# Altium project DAAD_DIMER.PrjPcb
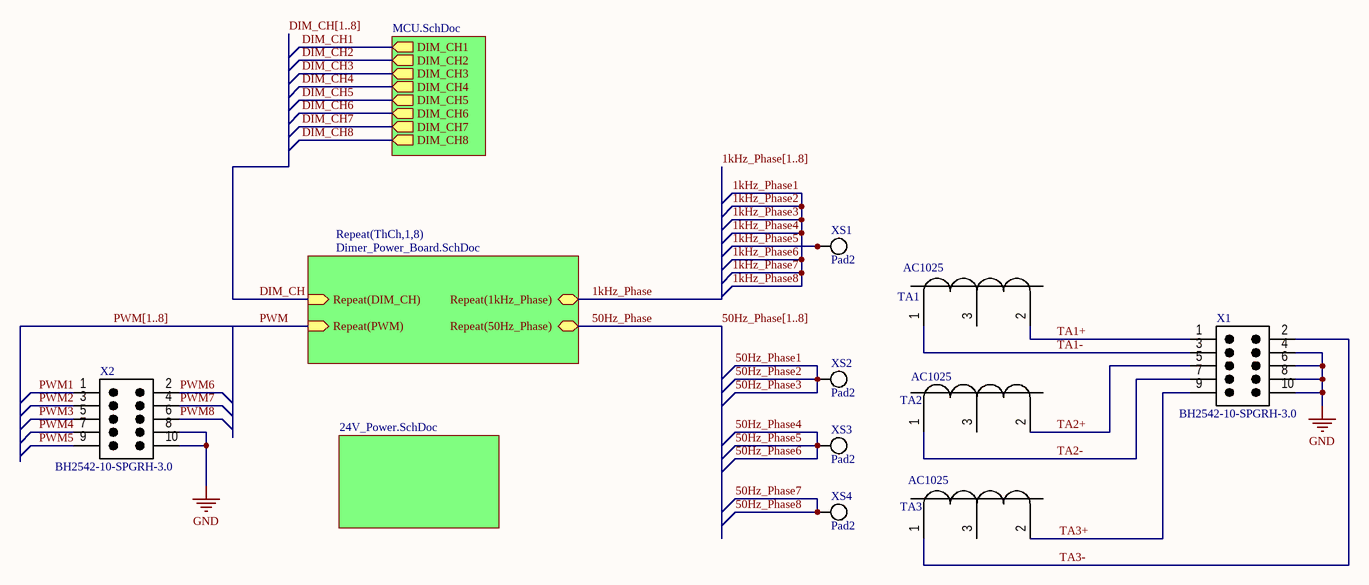
[diagram p0: DAAD_DIMER_Sheet.SchDoc]
4 sheets, 203 parts. Net scope: hierarchical (ports join the sheet entries above them; power ports are global).
Board file: DIMER_PCB.PcbDoc
Sheets:
  DAAD_DIMER_Sheet.SchDoc
    ThCh1 = Dimer_Power_Board.SchDoc
    ThCh2 = Dimer_Power_Board.SchDoc
    ThCh3 = Dimer_Power_Board.SchDoc
    ThCh4 = Dimer_Power_Board.SchDoc
    ThCh5 = Dimer_Power_Board.SchDoc
    ThCh6 = Dimer_Power_Board.SchDoc
    ThCh7 = Dimer_Power_Board.SchDoc
    ThCh8 = Dimer_Power_Board.SchDoc
    24V_Power = 24V_Power.SchDoc
    Designator = MCU.SchDoc

## Sheet DAAD_DIMER_Sheet.SchDoc: Багатоканальний пристрій регулювання потужності
size 420 x 297 mm; ApprovedBy: Хоменко М.А.; CheckedBy: Хоменко М.А.; Author: Шокодько Д.А.; CompanyName: НУЧП; DocumentNumber: МРА.EH 14194617; Revision: Хоменко М.А.; SheetNumber: 1; SheetTotal: 4; Scale: 1:1; Title2str: електричних нагрівальних елементів; DocumentType: Схема електрична принципова; FirstReferrence: АБВГ.123456.001; T_Contr: Хоменко М.А.; N_Contr: Хоменко М.А.

### Parts
TA1  AC1025  [10K_TRIM]
TA2  AC1025  [10K_TRIM]
TA3  AC1025  [10K_TRIM]
X1  BH2542-10-SPGRH-3.0  [PCE-BH2542-10-SPGRH-3.0]
X2  BH2542-10-SPGRH-3.0  [PCE-BH2542-10-SPGRH-3.0]
XS1  Pad2  [LOTPAD_2]
XS2  Pad2  [LOTPAD_2]
XS3  Pad2  [LOTPAD_2]
XS4  Pad2  [LOTPAD_2]

### Sub-sheets
24V_Power = 24V_Power.SchDoc: no entries
Designator = MCU.SchDoc: DIM_CH2 (out), DIM_CH5 (out), DIM_CH8 (out), DIM_CH6 (out), DIM_CH4 (out), DIM_CH3 (out), DIM_CH7 (out), DIM_CH1 (out)
Repeat(ThCh,1,8) = Dimer_Power_Board.SchDoc: Repeat(PWM) (in), Repeat(50Hz_Phase) (bidir), Repeat(DIM_CH) (in), Repeat(1kHz_Phase) (bidir)

### Nets
GND: X1.4 X1.6 X1.8 X1.10 X2.8 X2.10
1kHz_Phase: sheet Repeat(ThCh,1,8)/Repeat(1kHz_Phase)
1kHz_Phase5: XS1.1 XS1.2
50Hz_Phase: sheet Repeat(ThCh,1,8)/Repeat(50Hz_Phase)
50Hz_Phase1: XS2.1 XS2.2  [also labelled 50Hz_Phase2, 50Hz_Phase3]
50Hz_Phase4: XS3.1 XS3.2  [also labelled 50Hz_Phase5, 50Hz_Phase6]
50Hz_Phase7: XS4.1 XS4.2  [also labelled 50Hz_Phase8]
DIM_CH: sheet Repeat(ThCh,1,8)/Repeat(DIM_CH)
PWM: sheet Repeat(ThCh,1,8)/Repeat(PWM)
PWM1: X2.1
PWM2: X2.3
PWM3: X2.5
PWM4: X2.7
PWM5: X2.9
PWM6: X2.2
PWM7: X2.4
PWM8: X2.6
TA1+: TA1.2 X1.1
TA1-: TA1.1 X1.3
TA2+: TA2.2 X1.5
TA2-: TA2.1 X1.7
TA3+: TA3.2 X1.9
TA3-: TA3.1 X1.2

Not connected (* = marked no-connect by the designer): TA1 3; TA2 3; TA3 3

### Buses and harness runs
bus 1kHz_Phase[1..8]
bus 50Hz_Phase[1..8]
bus DIM_CH[1..8]
bus PWM[1..8]

### Notes on the sheet
- Перше використання
- Довідн. №
- Підп. і дата
- Інв. № дубл.
- Взамін інв. №
- Розроб.
- Зм.
- Лист
- № докум.
- Підп.
- Дата
- Літ.
- Маса
- Масштаб
- Перевір.
- Т.контр.
- Листів
- Інв. № оригін.
- Затв.
- Н.контр.
- 2.106-A3
- Формат А3

### Library data of the parts
TA1-TA3 = Talema 45/15 AC1025: Talema India Current Trancducer 45/15 AC1025
X1 X2 = PCE-HDR-2P-M-R10: Box Header, Pitch 2.54 mm, 2x5 Position, Height 9 mm, Tail Length 3 mm; Manufacturer: Pinchao Electronic; Insulator Material: NY-6T; Insulator resistance (Min.): 1000 Megohms; Plating: Gold Flash; No. of positions: 10; No. of Rows: 2; Dielectric Withstaanding: AC 500 V; Current Rating: 3 Amps; Pitch: 2.54 mm; ComponentLink1Description: Manufacturer URL; PartNumber: BH2542-10-SPGRH-3.0; PackageReference: BH2542-10-SPGRH-3.0; ComponentLink1URL: http://www.suzhoupinchao.com/; PackageDescription: Box Header, Pitch 2.54 mm, 2x5 Position, Height 9 mm, Tail Length 3 mm; Connector Type: Box Header; Mounting Technology: Through Hole; Operating Temperature: -40 to 105 degC
XS1-XS4 = Pad2: PCB TH Pad

## Sheet Dimer_Power_Board.SchDoc: Багатоканальний пристрій регулювавання потужності
size 420 x 297 mm; CheckedBy: Хоменко М.А.; Author: Шокодько Д.А.; CompanyName: НУЧП; DocumentNumber: МРА.ЕН 14194617; Revision: Хоменко М.А.; SheetNumber: 2; SheetTotal: 4; Scale: 1:1; Title2str: електричних нагрівальних елементів; DocumentType: Схема електрична принципова; FirstReferrence: АБВГ.123456.001; T_Contr: Хоменко М.А.; N_Contr: Хоменко М.А.
Used 8 times, as channels ThCh1, ThCh2, ThCh3, ThCh4, ThCh5, ThCh6, ThCh7, ThCh8. Parts and nets are listed once, with the designators drawn on the sheet.
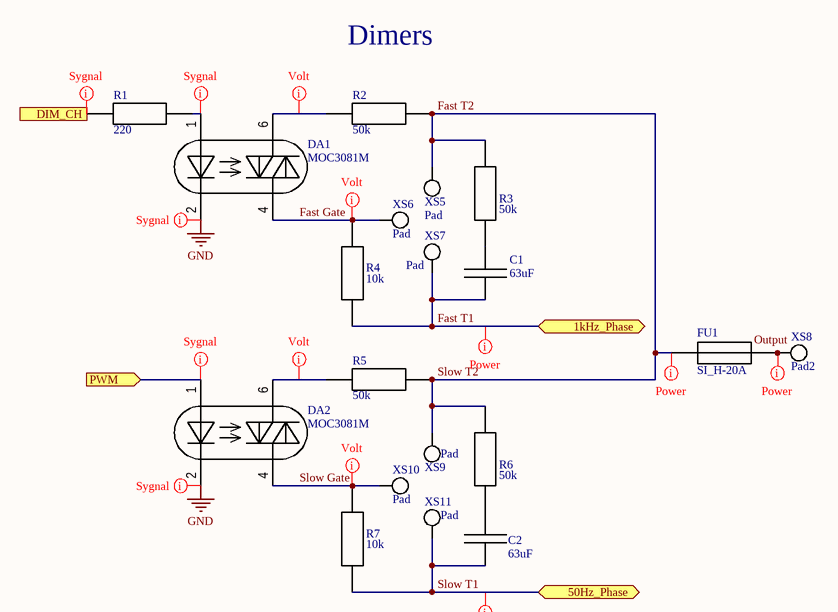
[diagram p1: Dimer_Power_Board.SchDoc]

### Parts
C1  63uF  [C-15]
C2  63uF  [C-15]
DA1  MOC3081M  [DIL-06]
DA2  MOC3081M  [DIL-06]
FU1  SI_H-20A  [SI_H-20A_]
R1  220  [RESC2012X06N]
R2  50k  [R-15]
R3  50k  [R-15]
R4  10k  [R-10]
R5  50k  [R-15]
R6  50k  [R-15]
R7  10k  [R-10]
XS5  Pad  [LOTPAD]
XS6  Pad  [LOTPAD]
XS7  Pad  [LOTPAD]
XS8  Pad2  [LOTPAD_2]
XS9  Pad  [LOTPAD]
XS10  Pad  [LOTPAD]
XS11  Pad  [LOTPAD]

### Ports
1kHz_Phase (bidir), 50Hz_Phase (bidir), DIM_CH (in), PWM (in)

### Nets
GND: DA1.2(Cathode) DA2.2(Cathode)
DIM_CH: R1.1 ; port DIM_CH
Fast Gate: DA1.4(Main_terminal) R4.2 XS6.1
Fast T1: C1.1 R4.1 XS7.1 ; port 1kHz_Phase
Fast T2: FU1.3 R2.2 R3.2 R5.2 R6.2 XS5.1 XS9.1  [also labelled Slow T2]
PWM: DA2.1(Anode) ; port PWM
Slow Gate: DA2.4(Main_terminal) R7.2 XS10.1
Slow T1: C2.1 R7.1 XS11.1 ; port 50Hz_Phase
NetC1_2: C1.2 R3.1
NetC2_2: C2.2 R6.1
NetDA1_1: DA1.1(Anode) R1.2
NetDA1_6: DA1.6(Main_terminal) R2.1
NetDA2_6: DA2.6(Main_terminal) R5.1
NetFU1_2: FU1.2 XS8.1 XS8.2

### Channels
ThCh1: designators end in _ThCh1; ports 1kHz_Phase=1kHz_Phase1 50Hz_Phase=50Hz_Phase1 DIM_CH=DIM_CH1 PWM=PWM1
ThCh2: designators end in _ThCh2; ports 1kHz_Phase=1kHz_Phase1 50Hz_Phase=50Hz_Phase1 DIM_CH=DIM_CH2 PWM=PWM2
ThCh3: designators end in _ThCh3; ports 1kHz_Phase=1kHz_Phase1 50Hz_Phase=50Hz_Phase1 DIM_CH=DIM_CH3 PWM=PWM3
ThCh4: designators end in _ThCh4; ports 1kHz_Phase=1kHz_Phase1 50Hz_Phase=50Hz_Phase4 DIM_CH=DIM_CH4 PWM=PWM4
ThCh5: designators end in _ThCh5; ports 1kHz_Phase=1kHz_Phase5 50Hz_Phase=50Hz_Phase4 DIM_CH=DIM_CH5 PWM=PWM5
ThCh6: designators end in _ThCh6; ports 1kHz_Phase=1kHz_Phase1 50Hz_Phase=50Hz_Phase4 DIM_CH=DIM_CH6 PWM=PWM6
ThCh7: designators end in _ThCh7; ports 1kHz_Phase=1kHz_Phase1 50Hz_Phase=50Hz_Phase7 DIM_CH=DIM_CH7 PWM=PWM7
ThCh8: designators end in _ThCh8; ports 1kHz_Phase=1kHz_Phase1 50Hz_Phase=50Hz_Phase7 DIM_CH=DIM_CH8 PWM=PWM8

### Layout directives
net class Sygnal; rule Width Constraint [Pref Width = 0.45mm    Min Width = 0.25mm    Max Width = 0.6mm]; rule Clearance Constraint [Clearance = 0.4mm]: DIM_CH1, GND, NetDA1_ThCh1_1, PWM1
net class Volt; rule Width Constraint [Pref Width = 0.7mm    Min Width = 0.4mm    Max Width = 1mm]; rule Clearance Constraint [Clearance = 3mm]: Fast Gate_ThCh1, NetDA1_ThCh1_6, NetDA2_ThCh1_6, Slow Gate_ThCh1
net class High Cur Volt; rule Width Constraint [Pref Width = 3.5mm    Min Width = 1.5mm    Max Width = 12mm]; rule Clearance Constraint [Clearance = 3mm]: 1kHz_Phase1, 50Hz_Phase1, Fast T2_ThCh1, NetFU1_ThCh1_2

### Notes on the sheet
- Dimers
- Labels drawn without touching a wire or pin: Output
- Перше використання
- Довідн. №
- Підп. і дата
- Інв. № дубл.
- Взамін інв. №
- Розроб.
- Зм.
- Лист
- № докум.
- Підп.
- Дата
- Літ.
- Маса
- Масштаб
- Перевір.
- Т.контр.
- Листів
- Інв. № оригін.
- Затв.
- Н.контр.
- 2.106-A3
- Формат А3

### Library data of the parts
C1 C2 = C_15: Value: *
DA1 DA2 = MOC3081M: MOC3081M Optosimistor Driver; ClassName: VS
FU1 = Fuse SI_H-20A: ClassName: FU
R1 = 220: Resistor
R2 R3 R5 R6 = Res_15: Value: *
R4 R7 = Res_10: Value: *
XS5-XS7 XS9-XS11 = Pad: PCB TH Pad
XS8 = Pad2: PCB TH Pad

## Sheet 24V_Power.SchDoc: Багатоканальний пристрій регулювання потужності
size 420 x 297 mm; CheckedBy: Хоменко М.А.; Author: Шокодько Д.А.; CompanyName: НУЧП; DocumentNumber: МРА.ЕН 14194617; Revision: Хоменко М.А.; SheetNumber: 3; SheetTotal: 4; Scale: 1:1; Title2str: електричних нагрівальних елементів; DocumentType: Схема електрична принципова; FirstReferrence: АБВГ.123456.001; T_Contr: Хоменко М.А.; N_Contr: Хоменко М.А.
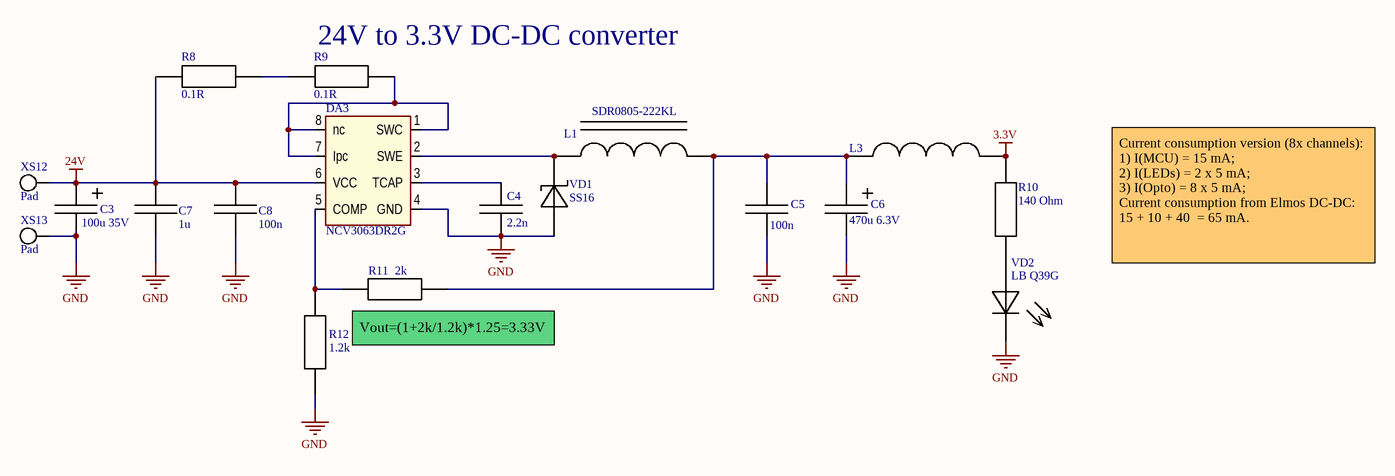
[diagram p2: 24V_Power.SchDoc]

### Parts
C3  100u 35V  [C8*12-3.5]
C4  2.2n  [C0603]
C5  100n  [C0603]
C6  470u 6.3V  [C6.3*11-2.5]
C7  1u  [C1206]
C8  100n  [C0603]
DA3  NCV3063DR2G  [SOIC-8 NB]
L1  SDR0805-222KL  [SDR0805]
L3  BLM21PG331SN1D  [INDC2012X08N]  (value not drawn)
R8  0.1R  [R1206]
R9  0.1R  [R1206]
R10  140 Ohm  [R0603]
R11  2k  [R0603]
R12  1.2k  [R0603]
VD1  SS16  [shotci]
VD2  LB Q39G  [0603D_R]
XS12  Pad  [LOTPAD]
XS13  Pad  [LOTPAD]

### Nets
3.3V: L3.2 R10.2
24V: C3.1 C7.2 C8.2 DA3.6(VCC) R8.1 XS12.1
GND: C3.2 C4.1 C5.1 C6.2 C7.1 C8.1 DA3.4(GND) R12.1 VD1.1(А) VD2.2(К) XS13.1
NetC4_2: C4.2 DA3.3(TCAP)
NetC5_2: C5.2 C6.1 L1.2 L3.1 R11.2
NetDA3_1: DA3.1(SWC) DA3.7(Ipc) DA3.8(nc) R9.2
NetDA3_2: DA3.2(SWE) L1.1 VD1.2(К)
NetDA3_5: DA3.5(COMP) R11.1 R12.2
NetR8_2: R8.2 R9.1
NetR10_1: R10.1 VD2.1(А)

### Notes on the sheet
- (near R9) 24V to 3.3V DC-DC converter
- Current consumption version (8x channels):
  1) I(MCU) = 15 mA;
  2) I(LEDs) = 2 x 5 mA;
  3) I(Opto) = 8 x 5 mA;
  Current consumption from Elmos DC-DC:
  15 + 10 + 40  = 65 mA.
- (near R11) Vout=(1+2k/1.2k)*1.25=3.33V
- Перше використання
- Довідн. №
- Підп. і дата
- Інв. № дубл.
- Взамін інв. №
- Розроб.
- Зм.
- Лист
- № докум.
- Підп.
- Дата
- Літ.
- Маса
- Масштаб
- Перевір.
- Т.контр.
- Листів
- Інв. № оригін.
- Затв.
- Н.контр.
- 2.106-A3
- Формат А3

### Library data of the parts
C3 = 100u 35V: Capasitor
C4 = 2.2n: Capasitor 0603
C5 C8 = 100n: Capasitor 0603
C6 = 470u 6.3V: Capasitor
C7 = 1u: Capasitor 1206
DA3 = NCV3063DR2G: 1.5 A, ADJ, Step-Up/Down/ / Inverting Switching / Regulators, SOIC-8
L1 = 2200uH: SMD Power Inductor
L3 = BLM21PG331SN1D: Ferrite bead smd
R8 R9 = 0.1R: Reisitor 1206
R10 = 140 Ohm: Resistor 0603
R11 = 2k: Resistor 0603
R12 = 1.2k: Resistor 0603
VD1 = SS16: Surface Mount Schottky Barrier Rectifier
VD2 = RED_LED: Power Led
XS12 XS13 = Pad: PCB TH Pad

## Sheet MCU.SchDoc: Багатоканальний пристрій регулювання потужності
size 420 x 297 mm; ApprovedBy: Хоменко М.А.; CheckedBy: Хоменко М.А.; Author: Шокодько Д.А.; CompanyName: НУЧП; DocumentNumber: МРА.ЕН 14194617; Revision: Хоменко М.А.; SheetNumber: 4; SheetTotal: 4; Scale: 1:1; Title2str: електричних нагрівальних елементів; DocumentType: Схема електрична принципова; FirstReferrence: АБВГ.123456.001; T_Contr: Хоменко М.А.; N_Contr: Хоменко М.А.
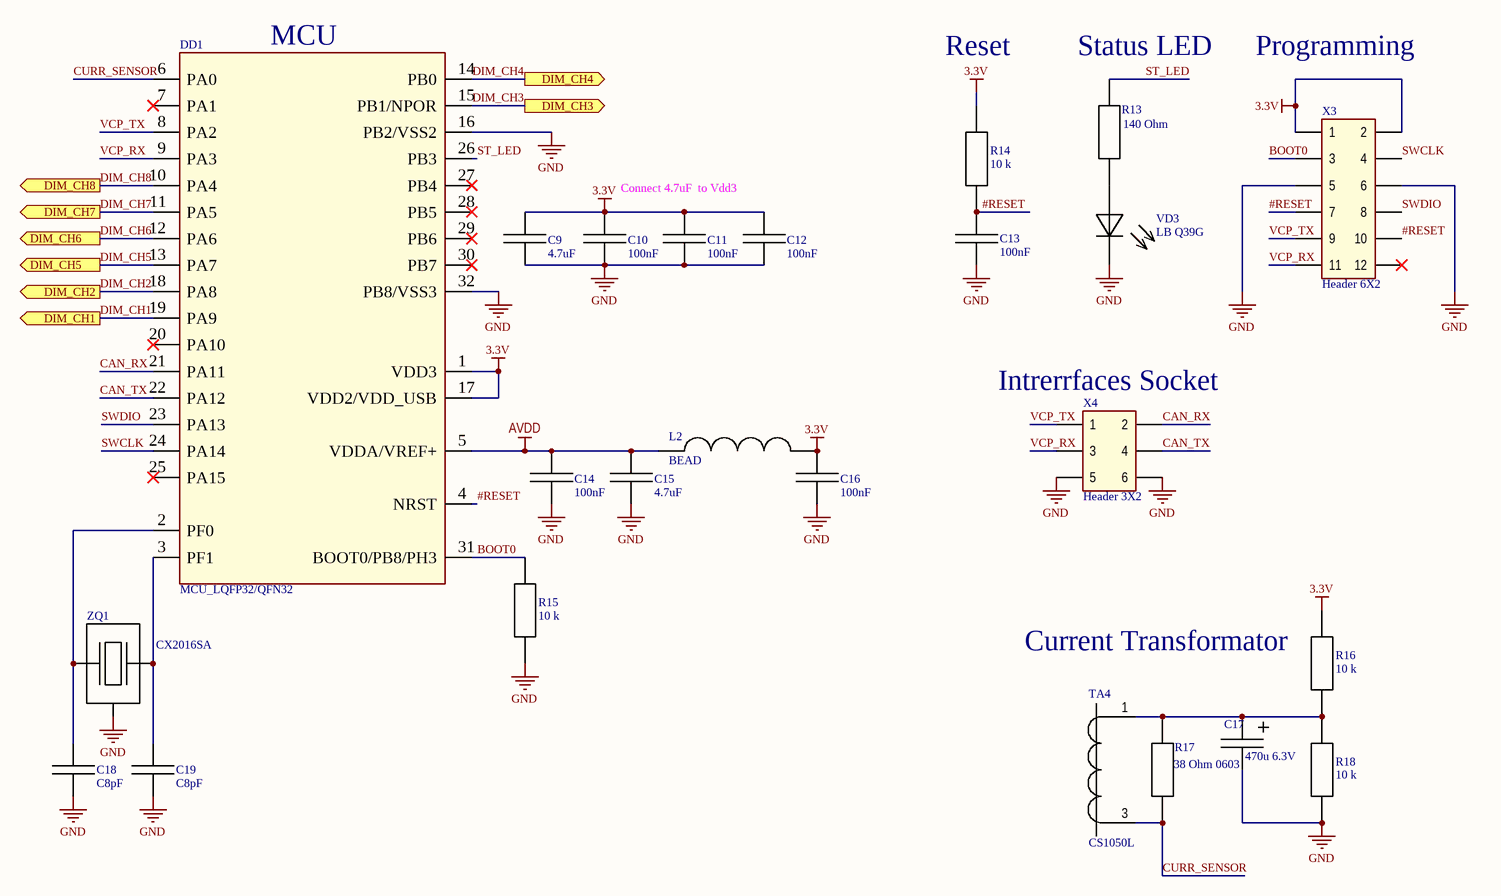
[diagram p3: MCU.SchDoc]

### Parts
C9  4.7uF  [0805C]
C10  100nF  [0603C]
C11  100nF  [0603C]
C12  100nF  [0603C]
C13  100nF  [0603C]
C14  100nF  [0603C]
C15  4.7uF  [0805C]
C16  100nF  [0603C]
C17  470u 6.3V  [C6.3*11-2.5]
C18  C8pF  [C0603]
C19  C8pF  [C0603]
DD1  MCU_LQFP32/QFN32  [LQFP32_0R5_7x7]
L2  BEAD  [0603L]
R13  140 Ohm  [R0603]
R14  10 k  [R0603]
R15  10 k  [R0603]
R16  10 k  [R0603]
R17  38 Ohm 0603  [R0603]
R18  10 k  [R0603]
TA4  CS1050L  [CS1200L]
VD3  LB Q39G  [0603D_G]
X3  Header 6X2  [DIP 2*6]
X4  Header 3X2  [DIP 2*3]
ZQ1  CX2016SA  [XTAL_2SM_3R2X1R5]

### Ports
DIM_CH1 (out), DIM_CH2 (out), DIM_CH3 (out), DIM_CH4 (out), DIM_CH5 (out), DIM_CH6 (out), DIM_CH7 (out), DIM_CH8 (out)

### Nets
3.3V: C9.2 C10.2 C11.2 C12.2 C16.2 DD1.1(VDD3) DD1.17(VDD2/VDD_USB) L2.2 R14.2 R16.2 X3.1 X3.2
AVDD: C14.2 C15.2 DD1.5(VDDA/VREF+) L2.1
GND: C9.1 C10.1 C11.1 C12.1 C13.1 C14.1 C15.1 C16.1 C17.2 C18.1 C19.1 DD1.16(PB2/VSS2) DD1.32(PB8/VSS3) R15.1 R18.1 VD3.2(К) X3.5 X3.6 X4.5 X4.6 ZQ1.2(GND)
#RESET: C13.2 DD1.4(NRST) R14.1 X3.7 X3.10
BOOT0: DD1.31(BOOT0/PB8/PH3) R15.2 X3.3
CAN_RX: DD1.21(PA11) X4.2
CAN_TX: DD1.22(PA12) X4.4
CURR_SENSOR: DD1.6(PA0) R17.1 TA4.3
DIM_CH1: DD1.19(PA9) ; port DIM_CH1
DIM_CH2: DD1.18(PA8) ; port DIM_CH2
DIM_CH3: DD1.15(PB1/NPOR) ; port DIM_CH3
DIM_CH4: DD1.14(PB0) ; port DIM_CH4
DIM_CH5: DD1.13(PA7) ; port DIM_CH5
DIM_CH6: DD1.12(PA6) ; port DIM_CH6
DIM_CH7: DD1.11(PA5) ; port DIM_CH7
DIM_CH8: DD1.10(PA4) ; port DIM_CH8
ST_LED: DD1.26(PB3) R13.2
SWCLK: DD1.24(PA14) X3.4
SWDIO: DD1.23(PA13) X3.8
VCP_RX: DD1.9(PA3) X3.11 X4.3
VCP_TX: DD1.8(PA2) X3.9 X4.1
NetC17_1: C17.1 R16.1 R17.2 R18.2 TA4.1
NetC18_2: C18.2 DD1.2(PF0) ZQ1.1(HOT)
NetC19_2: C19.2 DD1.3(PF1) ZQ1.3(HOT)
NetR13_1: R13.1 VD3.1(А)

Not connected (* = marked no-connect by the designer): DD1 7(PA1)* 20(PA10)* 25(PA15)* 27(PB4)* 28(PB5)* 29(PB6)* 30(PB7)*; X3 12*

### Notes on the sheet
- (near DD1) MCU
- Reset
- (near R13) Status LED
- Programming
- Connect 4.7uF  to Vdd3
- (near X4) Intrerrfaces Socket
- (near R16) Current Transformator
- Перше використання
- Довідн. №
- Підп. і дата
- Інв. № дубл.
- Взамін інв. №
- Розроб.
- Зм.
- Лист
- № докум.
- Підп.
- Дата
- Літ.
- Маса
- Масштаб
- Перевір.
- Т.контр.
- Листів
- Інв. № оригін.
- Затв.
- Н.контр.
- 2.106-A3
- Формат А3

### Library data of the parts
C9 C15 = 4.7uF: Capasitor 0805
C10-C14 C16 = 100nF: Capasitor 0603
C17 = 470u 6.3V: Capasitor
C18 C19 = C8pF: Capasitor 0603
DD1 = MCU_LQFP32: STM32F0
L2 = Inductor: Value: 100uH; Published: 8-Jun-2000; Revision: July-2002: Re-released for DXP Platform.; Publisher: Altium Limited
R13 = 140 Ohm: Resistor 0603
R14-R16 R18 = 10 k: Resistor 0603
R17 = 38 Ohm: Resistor
VD3 = GREEN_LED: Status Led
X4 = Header 3X2: Header 6X2
ZQ1 = CRYSTAL_32MHZ: Crystal CX2016SA

## Nets that join several sheets
3.3V: 24V_Power (L3.2 R10.2), MCU (12 pins)
GND: DAAD_DIMER_Sheet (6 pins), ThCh1 (DA1_ThCh1.2 DA2_ThCh1.2), ThCh2 (DA1_ThCh2.2 DA2_ThCh2.2), ThCh3 (DA1_ThCh3.2 DA2_ThCh3.2), ThCh4 (DA1_ThCh4.2 DA2_ThCh4.2), ThCh5 (DA1_ThCh5.2 DA2_ThCh5.2), ThCh6 (DA1_ThCh6.2 DA2_ThCh6.2), ThCh7 (DA1_ThCh7.2 DA2_ThCh7.2), ThCh8 (DA1_ThCh8.2 DA2_ThCh8.2), 24V_Power (11 pins), MCU (21 pins)
1kHz_Phase1: ThCh1 (C1_ThCh1.1 R4_ThCh1.1 XS7_ThCh1.1), ThCh2 (C1_ThCh2.1 R4_ThCh2.1 XS7_ThCh2.1), ThCh3 (C1_ThCh3.1 R4_ThCh3.1 XS7_ThCh3.1), ThCh4 (C1_ThCh4.1 R4_ThCh4.1 XS7_ThCh4.1), ThCh6 (C1_ThCh6.1 R4_ThCh6.1 XS7_ThCh6.1), ThCh7 (C1_ThCh7.1 R4_ThCh7.1 XS7_ThCh7.1), ThCh8 (C1_ThCh8.1 R4_ThCh8.1 XS7_ThCh8.1)
1kHz_Phase5: DAAD_DIMER_Sheet (XS1.1 XS1.2), ThCh5 (C1_ThCh5.1 R4_ThCh5.1 XS7_ThCh5.1)
50Hz_Phase1: DAAD_DIMER_Sheet (XS2.1 XS2.2), ThCh1 (C2_ThCh1.1 R7_ThCh1.1 XS11_ThCh1.1), ThCh2 (C2_ThCh2.1 R7_ThCh2.1 XS11_ThCh2.1), ThCh3 (C2_ThCh3.1 R7_ThCh3.1 XS11_ThCh3.1)
50Hz_Phase4: DAAD_DIMER_Sheet (XS3.1 XS3.2), ThCh4 (C2_ThCh4.1 R7_ThCh4.1 XS11_ThCh4.1), ThCh5 (C2_ThCh5.1 R7_ThCh5.1 XS11_ThCh5.1), ThCh6 (C2_ThCh6.1 R7_ThCh6.1 XS11_ThCh6.1)
50Hz_Phase7: DAAD_DIMER_Sheet (XS4.1 XS4.2), ThCh7 (C2_ThCh7.1 R7_ThCh7.1 XS11_ThCh7.1), ThCh8 (C2_ThCh8.1 R7_ThCh8.1 XS11_ThCh8.1)
DIM_CH1: ThCh1 (R1_ThCh1.1), MCU (DD1.19)
DIM_CH2: ThCh2 (R1_ThCh2.1), MCU (DD1.18)
DIM_CH3: ThCh3 (R1_ThCh3.1), MCU (DD1.15)
DIM_CH4: ThCh4 (R1_ThCh4.1), MCU (DD1.14)
DIM_CH5: ThCh5 (R1_ThCh5.1), MCU (DD1.13)
DIM_CH6: ThCh6 (R1_ThCh6.1), MCU (DD1.12)
DIM_CH7: ThCh7 (R1_ThCh7.1), MCU (DD1.11)
DIM_CH8: ThCh8 (R1_ThCh8.1), MCU (DD1.10)
PWM1: DAAD_DIMER_Sheet (X2.1), ThCh1 (DA2_ThCh1.1)
PWM2: DAAD_DIMER_Sheet (X2.3), ThCh2 (DA2_ThCh2.1)
PWM3: DAAD_DIMER_Sheet (X2.5), ThCh3 (DA2_ThCh3.1)
PWM4: DAAD_DIMER_Sheet (X2.7), ThCh4 (DA2_ThCh4.1)
PWM5: DAAD_DIMER_Sheet (X2.9), ThCh5 (DA2_ThCh5.1)
PWM6: DAAD_DIMER_Sheet (X2.2), ThCh6 (DA2_ThCh6.1)
PWM7: DAAD_DIMER_Sheet (X2.4), ThCh7 (DA2_ThCh7.1)
PWM8: DAAD_DIMER_Sheet (X2.6), ThCh8 (DA2_ThCh8.1)